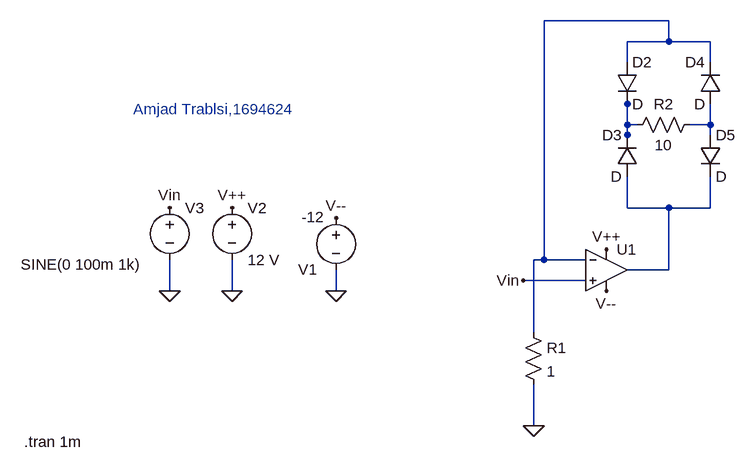
[diagram p0: schematic 4_3_Messinstrument.asc]
4_3_Messinstrument.asc, the LTspice schematic file:
Version 4
SHEET 1 908 680
WIRE 800 -160 608 -160
WIRE 800 -128 800 -160
WIRE 800 -128 736 -128
WIRE 864 -128 800 -128
WIRE 736 -96 736 -128
WIRE 864 -96 864 -128
WIRE 736 -32 736 -48
WIRE 736 0 736 -32
WIRE 752 0 736 0
WIRE 864 0 864 -32
WIRE 864 0 832 0
WIRE 736 16 736 0
WIRE 864 16 864 0
WIRE 736 32 736 16
WIRE 736 128 736 80
WIRE 800 128 736 128
WIRE 864 128 864 80
WIRE 864 128 800 128
WIRE 608 208 608 -160
WIRE 608 208 592 208
WIRE 672 208 608 208
WIRE 800 224 800 128
WIRE 800 224 736 224
WIRE 672 240 576 240
WIRE 32 256 32 208
WIRE 128 256 128 208
WIRE 288 256 288 224
WIRE 592 320 592 208
WIRE 592 464 592 400
FLAG 128 256 0
FLAG 32 256 0
FLAG 32 128 Vin
FLAG 288 256 0
FLAG 288 144 V--
FLAG 704 256 V--
FLAG 128 128 V++
FLAG 704 192 V++
FLAG 576 240 Vin
FLAG 592 464 0
SYMBOL voltage 288 128 R0
WINDOW 0 -58 95 Left 2
WINDOW 3 -53 14 Left 2
WINDOW 123 0 0 Left 0
WINDOW 39 0 0 Left 0
SYMATTR InstName V1
SYMATTR Value -12
SYMBOL voltage 128 112 R0
WINDOW 123 0 0 Left 0
WINDOW 39 0 0 Left 0
SYMATTR InstName V2
SYMATTR Value 12 V
SYMBOL voltage 32 112 R0
WINDOW 3 -229 103 Left 2
WINDOW 123 0 0 Left 0
WINDOW 39 0 0 Left 0
SYMATTR InstName V3
SYMATTR Value SINE(0 100m 1k)
SYMBOL OpAmps\\UniversalOpAmp 704 224 R0
SYMATTR InstName U1
SYMBOL res 576 304 R0
SYMATTR InstName R1
SYMATTR Value 1
SYMBOL diode 720 -96 R0
SYMATTR InstName D2
SYMBOL diode 752 80 R180
WINDOW 0 24 64 Left 2
WINDOW 3 24 0 Left 2
SYMATTR InstName D3
SYMBOL diode 880 -32 R180
WINDOW 0 24 64 Left 2
WINDOW 3 24 0 Left 2
SYMATTR InstName D4
SYMBOL diode 848 16 R0
SYMATTR InstName D5
SYMBOL res 848 -16 R90
WINDOW 0 0 56 VBottom 2
WINDOW 3 32 56 VTop 2
SYMATTR InstName R2
SYMATTR Value 10
TEXT -24 -24 Left 2 ;Amjad Trablsi,1694624
TEXT -192 488 Left 2 !.tran 1m

The netlist it stands for:
* 4_3_Messinstrument.asc
V1 V-- 0 -12
V2 V++ 0 12 V
V3 Vin 0 SINE(0 100m 1k)
XU1 Vin N001 V++ V-- N004 level1 Avol=1Meg GBW=10Meg Vos=0 En=0 Enk=0 In=0 Ink=0 Rin=500Meg  ; pins In+ In- V+ V- OUT
R1 N001 0 1
D2 N001 N002 D
D3 N004 N002 D
D4 N003 N001 D
D5 N003 N004 D
R2 N003 N002 10
.model D D
.lib standard.dio
* Amjad Trablsi,1694624
.tran 1m
.lib UniversalOpAmp1.lib
.backanno
.end